# Altium schematic sheet Source Selection.SchDoc
size A3
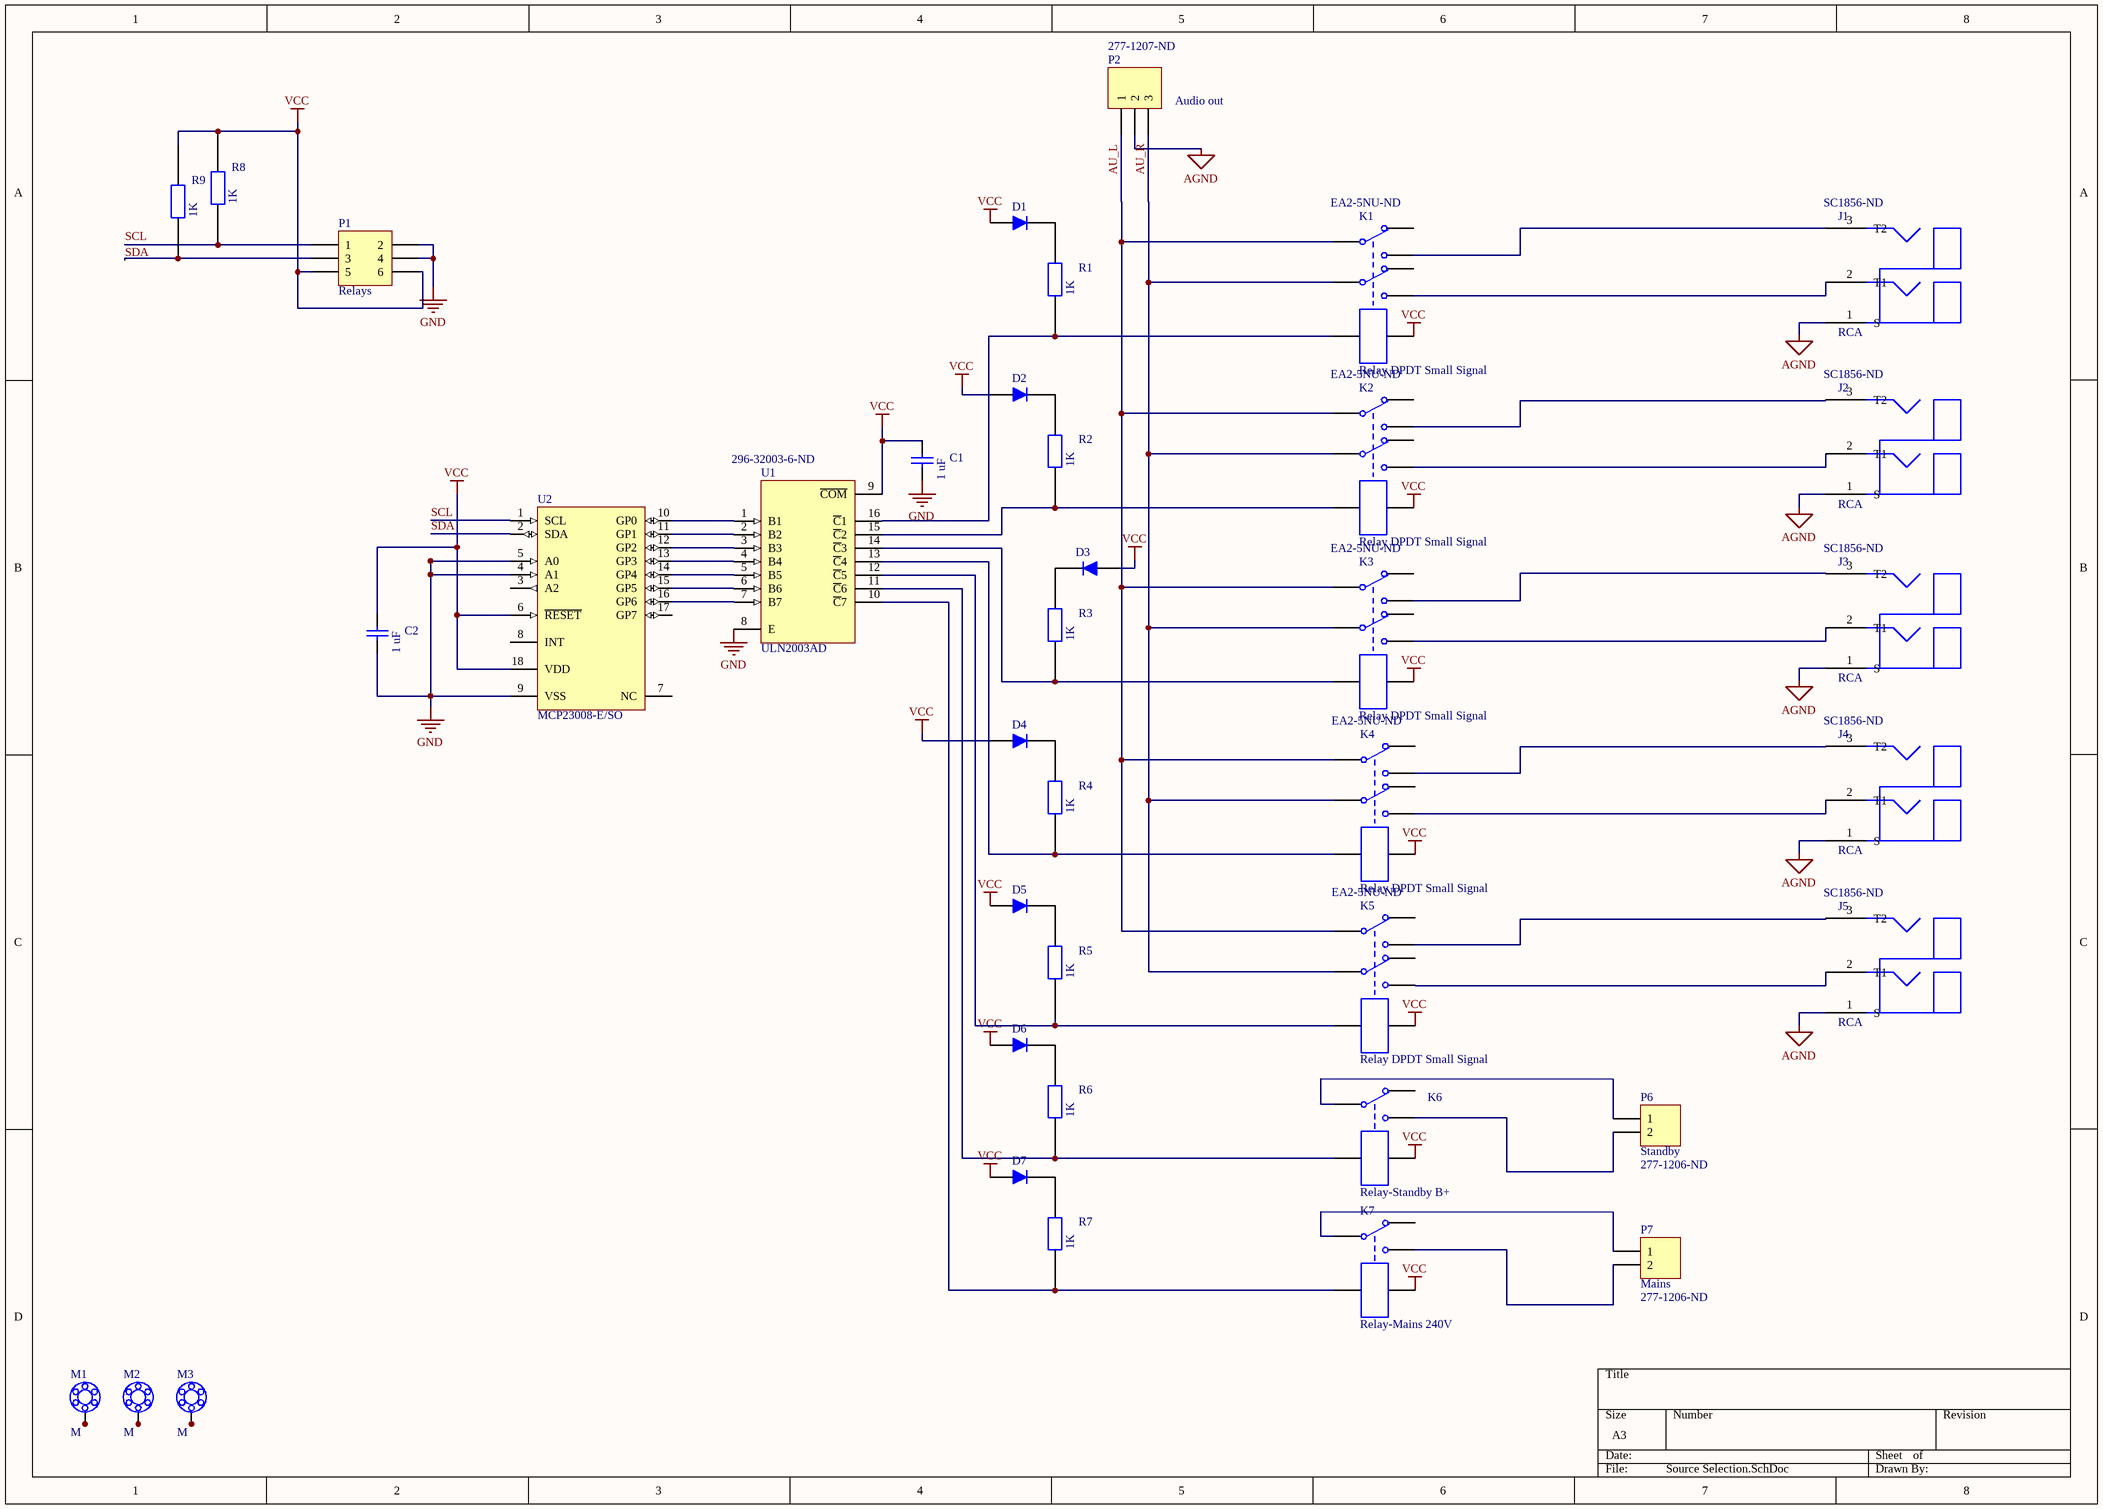
[diagram p0: Source Selection.SchDoc]

## Parts
C1  GCM188R71C105KA64D  [CAPC1608]  (value not drawn)
C2  GCM188R71C105KA64D  [CAPC1608]  (value not drawn)
D1  LTST-C191KGKT  [LEDC1608M_AK]  (value not drawn)
D2  LTST-C191KGKT  [LEDC1608M_AK]  (value not drawn)
D3  LTST-C191KGKT  [LEDC1608M_AK]  (value not drawn)
D4  LTST-C191KGKT  [LEDC1608M_AK]  (value not drawn)
D5  LTST-C191KGKT  [LEDC1608M_AK]  (value not drawn)
D6  LTST-C191KGKT  [LEDC1608M_AK]  (value not drawn)
D7  LTST-C191KGKT  [LEDC1608M_AK]  (value not drawn)
J1  RCA  Supplier Part Number 1: SC1856-ND  [PJRAS1X2S01AUX]
J2  RCA  Supplier Part Number 1: SC1856-ND  [PJRAS1X2S01AUX]
J3  RCA  Supplier Part Number 1: SC1856-ND  [PJRAS1X2S01AUX]
J4  RCA  Supplier Part Number 1: SC1856-ND  [PJRAS1X2S01AUX]
J5  RCA  Supplier Part Number 1: SC1856-ND  [PJRAS1X2S01AUX]
K1  Relay DPDT Small Signal  Supplier Part Number 1: EA2-5NU-ND  [DIP-P10]
K2  Relay DPDT Small Signal  Supplier Part Number 1: EA2-5NU-ND  [DIP-P10]
K3  Relay DPDT Small Signal  Supplier Part Number 1: EA2-5NU-ND  [DIP-P10]
K4  Relay DPDT Small Signal  Supplier Part Number 1: EA2-5NU-ND  [DIP-P10]
K5  Relay DPDT Small Signal  Supplier Part Number 1: EA2-5NU-ND  [DIP-P10]
K6  Relay-Standby B+  [RELAY_SPDT]
K7  Relay-Mains 240V  [RELAY_SPDT]
M1  M  [MOUNTING]  (no BOM)
M2  M  [MOUNTING]  (no BOM)
M3  M  [MOUNTING]  (no BOM)
P1  Relays  [IDC2.54-H6C]
P2  Audio out  Supplier Part Number 1: 277-1207-ND  [PH_TERM_3]
P6  Standby  Supplier Part Number 1: 277-1206-ND  [PH_TERM_2]
P7  Mains  Supplier Part Number 1: 277-1206-ND  [PH_TERM_2]
R1  CR0603-FX-1001ELF  [RESC1608]  (value not drawn)
R2  CR0603-FX-1001ELF  [RESC1608]  (value not drawn)
R3  CR0603-FX-1001ELF  [RESC1608]  (value not drawn)
R4  CR0603-FX-1001ELF  [RESC1608]  (value not drawn)
R5  CR0603-FX-1001ELF  [RESC1608]  (value not drawn)
R6  CR0603-FX-1001ELF  [RESC1608]  (value not drawn)
R7  CR0603-FX-1001ELF  [RESC1608]  (value not drawn)
R8  CR0603-FX-1001ELF  [RESC1608]  (value not drawn)
R9  CR0603-FX-1001ELF  [RESC1608]  (value not drawn)
U1  ULN2003AD  Supplier Part Number 1: 296-32003-6-ND  [D016_N]
U2  MCP23008-E/SO  [SOIC-SO18_N]

## Nets
AGND: J1.1(S) J2.1(S) J3.1(S) J4.1(S) J5.1(S) P2.2
GND: C1.1 C2.1 P1.2 P1.4 U1.8(E) U2.4(A1) U2.5(A0) U2.9(VSS)
VCC: C1.2 C2.2 D1.A D2.A D3.A D4.A D5.A D6.A D7.A K1.10 K2.10 K3.10 K4.10 K5.10 K6.3 K7.3 P1.5 P1.6 R8.2 R9.2 U1.9(~{COM}) U2.6(~{RESET}) U2.18(VDD)
AU_L: K1.3 K2.3 K3.3 K4.3 K5.3 P2.1
AU_R: K1.8 K2.8 K3.8 K4.8 K5.8 P2.3
SCL: P1.1 R8.1 U2.1(SCL)
SDA: P1.3 R9.1 U2.2(SDA)
NetD1_K: D1.K R1.2
NetD2_K: D2.K R2.2
NetD3_K: D3.K R3.2
NetD4_K: D4.K R4.2
NetD5_K: D5.K R5.2
NetD6_K: D6.K R6.2
NetD7_K: D7.K R7.2
NetJ1_2: J1.2(T1) K1.7
NetJ1_3: J1.3(T2) K1.4
NetJ2_2: J2.2(T1) K2.7
NetJ2_3: J2.3(T2) K2.4
NetJ3_2: J3.2(T1) K3.7
NetJ3_3: J3.3(T2) K3.4
NetJ4_2: J4.2(T1) K4.7
NetJ4_3: J4.3(T2) K4.4
NetJ5_2: J5.2(T1) K5.7
NetJ5_3: J5.3(T2) K5.4
NetK1_1: K1.1 R1.1 U1.16(~{C}1)
NetK2_1: K2.1 R2.1 U1.15(~{C}2)
NetK3_1: K3.1 R3.1 U1.14(~{C}3)
NetK4_1: K4.1 R4.1 U1.13(~{C}4)
NetK5_1: K5.1 R5.1 U1.12(~{C}5)
NetK6_1: K6.1 R6.1 U1.11(~{C}6)
NetK6_2: K6.2 P6.1
NetK6_5: K6.5 P6.2
NetK7_1: K7.1 R7.1 U1.10(~{C}7)
NetK7_2: K7.2 P7.1
NetK7_5: K7.5 P7.2
NetM1_1: M1.1 M1.2 M1.3 M1.4 M1.5 M1.6 M1.7
NetM2_1: M2.1 M2.2 M2.3 M2.4 M2.5 M2.6 M2.7
NetM3_1: M3.1 M3.2 M3.3 M3.4 M3.5 M3.6 M3.7
NetU1_1: U1.1(B1) U2.10(GP0)
NetU1_2: U1.2(B2) U2.11(GP1)
NetU1_3: U1.3(B3) U2.12(GP2)
NetU1_4: U1.4(B4) U2.13(GP3)
NetU1_5: U1.5(B5) U2.14(GP4)
NetU1_6: U1.6(B6) U2.15(GP5)
NetU1_7: U1.7(B7) U2.16(GP6)

Not connected (* = marked no-connect by the designer): K1 2 9; K2 2 9; K3 2 9; K4 2 9; K5 2 9; K6 4; K7 4; U2 3(A2) 7(NC) 8(INT) 17(GP7)

## Notes on the sheet
- (in symbol CR0603-FX-1001ELF) 1K

## Library data of the parts
C1 C2 = GCM188R71C105KA64D: Multilayer Ceramic Capacitors MLCC - SMD/SMT 0603 1.0uF 16volts X7R 10%; Manufacturer: Murata Electronics; Capacitance: 1 uF; Type: Automotive Ultra Small MLCC; Voltage Rating DC: 16 V; Supplier 1: Mouser; Manufacturer Part Number: GCM188R71C105KA64D; RoHS: RoHS Compliant; Category: Multilayer Ceramic Capacitors MLCC - SMD/SMT; Stock 1: 196143; Pricing 1: 1=0.432, 10=0.206, 100=0.122, 1000=0.114, 4000=0.080, 8000=0.077, 24000=0.074, 48000=0.069, 100000=0.061 (AUD); Height: 0.8 mm; Length: 1.6 mm; Package / Case: 0603 (1608 metric); Packaging: Reel; Product: Automotive MLCCs; Series: GCM; Termination Style: SMD/SMT; Tolerance: 10 %; Width: 0.8 mm; Brand: Murata Electronics; Case Code - in: 0603; Case Code - mm: 1608; Dielectric: X7R; Maximum Operating Temperature: + 125 C; Minimum Operating Temperature: - 55 C; Product Category: Automotive Ceramic Chip Capacitors; Standard Pack Qty: 4000; RoHS - Mouser: Y; Minimum Order Quantity: 1; Reeling: True; ComponentLink1URL: http://www.mouser.com/ds/2/281/c03e-516224.pdf; ComponentLink1Description: http://www.mouser.com/ds/2/281/c03e-516224.pdf; Supplier Part Number 1: 81-GCM188R71C105K64D
D1-D7 = LTST-C191KGKT: LED GREEN CLEAR 0603 SMD; Manufacturer: Lite-On Inc.; Wavelength - Dominant: 571nm; Wavelength - Peak: 574nm; Millicandela Rating: 35mcd; Voltage - Forward (Vf) (Typ): 2V; Current - Test: 20mA; Viewing Angle: 130°; Lens Color: Colorless; Lens Style/Size: Rectangle with Flat Top, 1.10mm x 0.80mm; Supplier 1: Digi-Key; Manufacturer Part Number: LTST-C191KGKT; RoHS: RoHS Compliant; Category: Optoelectronics; Stock 1: 654931; Pricing 1: 1=0.36, 10=0.284, 100=0.1549, 250=0.10328, 500=0.08778, 1000=0.06712, 2500=0.06067 (AUD); Packaging: Cut Tape (CT); Color: Green; Lens Transparency: Clear; Package / Case: 0603 (1608 Metric); Supplier Device Package: *; Size / Dimension: 1.60mm L x 0.80mm W; Height (Max): 0.55mm; Mounting Type: Surface Mount; ComponentLink1URL: http://optoelectronics.liteon.com/upload/download/DS22-2000-228/S_110_LTST-C191KGKT.pdf; ComponentLink1Description: http://optoelectronics.liteon.com/upload/download/DS22-2000-228/S_110_LTST-C191KGKT.pdf; Supplier Part Number 1: 160-1446-1-ND
J1-J5 = RCA Dual PCB: Manufacturer: Switchcraft Inc.; Connector Type: Phono (RCA) Jack; Gender: Female; Signal Lines: Mono; Plug/Mating Plug Diameter: 3.20mm ID, 9.00mm OD (RCA); Number of Positions/Contacts: 2 Sets of 2 Conductors, 3 Contacts; Internal Switch(s): Does Not Contain Switch; Shielding: Shielded; Color - Contact: Red, White; Voltage - Rated: 34VAC/DC; Current Rating: 2A; Supplier 1: Digi-Key; Manufacturer Part Number: PJRAS1X2S01AUX; RoHS: RoHS Compliant; Category: Connectors, Interconnects; Stock 1: 0; Pricing 1: 1000=1.66304 (AUD); Packaging: -; Mounting Type: Through Hole, Right Angle; Termination: Solder; Features: Grounding Tab; Contact Material: Copper Alloy; Contact Material - Plating: Gold; Housing Material: Thermoplastic; Housing Color: Black; Operating Temperature: -25°C ~ 85°C; ComponentLink1URL: http://www.switchcraft.com/Drawings/pjras1x2s__x_series_cd.pdf; ComponentLink1Description: http://www.switchcraft.com/Drawings/pjras1x2s__x_series_cd.pdf
K1-K5 = Relay DPDT Small Signal: Manufacturer: Kemet; Manufacturer Part Number: EA2-5NU; Supplier 1: Digi-Key; RoHS: RoHS Compliant; Category: Relays; Stock 1: 0; Pricing 1: 3600=1.65766 (AUD); ComponentLink1URL: http://www.kemet.com/docfinder?Partnumber=EA2-5NU; ComponentLink1Description: http://www.kemet.com/docfinder?Partnumber=EA2-5NU
K6 K7 = Relay SPDT
M1-M3 = MOUNTING: MOUNTING HOLE - NON INSTALLABLE
P1 = Header 3X2H: Header, 3-Pin, Dual row, Right Angle; Manufacturer: Wurth Electronics Inc; Manufacturer Part Number: 61200621721; Connector Type: Header, Shrouded; Number of Positions: 6; Number of Positions Loaded: All; Pitch: 0.100" (2.54mm); LatestRevisionDate: 17-Jul-2002; LatestRevisionNote: Re-released for DXP Platform.; Publisher: Altium Limited; Supplier 1: Digi-Key; Supplier Part Number 1: 732-5404-ND; RoHS: RoHS Compliant; Category: Connectors, Interconnects; Stock 1: 301; Pricing 1: 1=1.75, 100=1.5642, 500=1.32352 (AUD); Packaging: Tray; Contact Type: Male Pin; Number of Rows: 2; Row Spacing: 0.100" (2.54mm); Contact Mating Length: -; Mounting Type: Through Hole, Right Angle; Termination: Solder; Fastening Type: -; Features: -; Contact Finish: Gold; Contact Finish Thickness: -; Color: Black; ComponentLink1URL: http://katalog.we-online.de/em/datasheet/6120xx21721.pdf; ComponentLink1Description: http://katalog.we-online.de/em/datasheet/6120xx21721.pdf
P2 = Header 3: Header, 3-Pin; Manufacturer: Phoenix Contact; Manufacturer Part Number: 1803280; Number of Positions: 3; Number of Levels: 1; Pitch: 0.150" (3.81mm); Header Orientation: 90°, Right Angle; Current - IEC: 8A; Voltage - IEC: 250V; Voltage - UL: 300V; LatestRevisionDate: 17-Jul-2002; LatestRevisionNote: Re-released for DXP Platform.; Publisher: Altium Limited; Supplier 1: Digi-Key; RoHS: RoHS Compliant; Category: Connectors, Interconnects; Stock 1: 2295; Pricing 1: 1=1.59, 10=1.531, 50=1.4654, 100=1.4254, 250=1.33216, 500=1.22558, 1000=1.11013, 2500=1.05788, 5000=0.99258 (AUD); Packaging: Bulk; Type: Header, Male Pins, Shrouded (4 Side); Positions Per Level: 3; Plug Wire Entry: -; Termination Style: Solder; Mounting Type: Through Hole; Current - UL: 8A; Wire Gauge or Range - AWG: -; Wire Gauge or Range - mm²: -; Color: Green; Operating Temperature: -; Contact Mating Finish: Tin; Features: -; ComponentLink1URL: http://media.digikey.com/pdf/Data%20Sheets/Phoenix%20Contact%20PDFs/1803280.pdf; ComponentLink1Description: http://media.digikey.com/pdf/Data%20Sheets/Phoenix%20Contact%20PDFs/1803280.pdf
P6 P7 = Header 2: Header, 2-Pin; Manufacturer: Phoenix Contact; Manufacturer Part Number: 1803277; Number of Positions: 2; Number of Levels: 1; Pitch: 0.150" (3.81mm); Header Orientation: 90°, Right Angle; Current - IEC: 8A; Voltage - IEC: 250V; Voltage - UL: 300V; LatestRevisionDate: 17-Jul-2002; LatestRevisionNote: Re-released for DXP Platform.; Publisher: Altium Limited; Supplier 1: Digi-Key; RoHS: RoHS Compliant; Category: Connectors, Interconnects; Stock 1: 5115; Pricing 1: 1=1.05, 10=1.01, 50=0.9662, 100=0.9398, 250=0.87836, 500=0.80808, 1000=0.73195, 2500=0.69751, 5000=0.65445 (AUD); Packaging: Bulk; Type: Header, Male Pins, Shrouded (4 Side); Positions Per Level: 2; Plug Wire Entry: -; Termination Style: Solder; Mounting Type: Through Hole; Current - UL: 8A; Wire Gauge or Range - AWG: -; Wire Gauge or Range - mm²: -; Color: Green; Operating Temperature: -; Contact Mating Finish: Tin; Features: -; ComponentLink1URL: http://media.digikey.com/pdf/Data%20Sheets/Phoenix%20Contact%20PDFs/1803277.pdf; ComponentLink1Description: http://media.digikey.com/pdf/Data%20Sheets/Phoenix%20Contact%20PDFs/1803277.pdf
R1-R9 = CR0603-FX-1001ELF: RES SMD 1K OHM 1% 1/10W 0603; Manufacturer: Bourns Inc.; Power (Watts): 0.1W, 1/10W; Temperature Coefficient: ±100ppm/°C; Supplier 1: Digi-Key; Manufacturer Part Number: CR0603-FX-1001ELF; RoHS: RoHS Compliant; Category: Resistors; Stock 1: 28425; Pricing 1: 1=0.14, 10=0.065, 25=0.0472, 50=0.036, 100=0.0266, 250=0.02024, 500=0.01618, 1000=0.01193, 2500=0.01035 (AUD); Packaging: Digi-Reel®; Resistance (Ohms): 1k; Tolerance: ±1%; Composition: Thick Film; Features: Moisture Resistant; Operating Temperature: -55°C ~ 155°C; Package / Case: 0603 (1608 Metric); Supplier Device Package: 0603; Size / Dimension: 0.063" L x 0.031" W (1.60mm x 0.80mm); Height: 0.022" (0.55mm); Number of Terminations: 2; ComponentLink1URL: http://www.bourns.com/docs/Product-Datasheets/CHPREZTR.pdf; ComponentLink1Description: http://www.bourns.com/docs/Product-Datasheets/CHPREZTR.pdf; Supplier Part Number 1: CR0603-FX-1001ELFDKR-ND
U1 = ULN2003AD: Darlington Transistor Array; Manufacturer: Texas Instruments; Manufacturer Part Number: ULN2003ADRG4; Transistor Type: 7 NPN Darlington; Current - Collector (Ic) (Max): 500mA; Voltage - Collector Emitter Breakdown (Max): 50V; Vce Saturation (Max) @ Ib, Ic: 1.6V @ 500µA, 350mA; Published: 15-May-2002; LatestRevisionDate: 13-Apr-2006; LatestRevisionNote: IPC-7351 Footprint Added.; DatasheetVersion: Sep-1986; PackageVersion: Jan-1998; PackageReference: D016; Publisher: Altium Limited; PackageDescription: 16-Pin Small Outline Integrated Circuit 1.27 mm Pitch; Code_IPC: SOIC127P600-16; ComponentLink1Description: Manufacturer Link; ComponentLink1URL: http://www.ti.com/; ComponentLink2Description: Datasheet; ComponentLink2URL: http://www-s.ti.com/sc/ds/uln2002a.pdf; Supplier 1: Digi-Key; RoHS: RoHS Compliant; Category: Discrete Semiconductor Products; Stock 1: 3953; Pricing 1: 1=0.78, 10=0.666, 100=0.4977, 500=0.39094, 1000=0.30139 (AUD); Packaging: Digi-Reel®; Current - Collector Cutoff (Max): -; DC Current Gain (hFE) (Min) @ Ic, Vce: -; Power - Max: -; Frequency - Transition: -; Mounting Type: Surface Mount; Package / Case: 16-SOIC (0.154", 3.90mm Width); Supplier Device Package: 16-SOIC; ComponentLink3URL: http://www.ti.com/lit/ds/symlink/uln2003a.pdf; ComponentLink3Description: http://www.ti.com/lit/ds/symlink/uln2003a.pdf
U2 = MCP23008-E/SO: 8-Bit I/O Expander with Serial Interface, 18-Pin SOIC, Extended Temperature; Manufacturer: Microchip Technology; Number of I/O: 8; Interface: I²C; Interrupt Output: Yes; Output Type: Open Drain; Current - Output Source/Sink: 25mA; Frequency - Clock: 1.7MHz; Voltage - Supply: 1.8 V ~ 5.5 V; Published: 29-Jan-2009; DatasheetVersion: revE, Aug-2007; PackageVersion: revBB, Aug-2009; PackageReference: SOIC-SO18; Publisher: Altium Limited; PackageDescription: 18-Lead Plastic Small Outline (SO) - Wide 7.50mm Body [SOIC]; Supplier 1: Digi-Key; Supplier Part Number 1: MCP23008-E/SO-ND; Supplier 2: Farnell; Supplier Part Number 2: 1332086; Code_JEDEC: MS-013; ComponentLink1Description: Datasheet; ComponentLink1URL: http://ww1.microchip.com/downloads/en/DeviceDoc/21919e.pdf; ComponentLink2Description: Packaging Specification; ComponentLink2URL: http://www.microchip.com/stellent/groups/techpub_sg/documents/packagingspec/en012702.pdf; ComponentLink3Description: Microchip.com Home; ComponentLink3URL: http://www.microchip.com/; Manufacturer Part Number: MCP23008-E/SO; RoHS: RoHS Compliant; Category: Integrated Circuits (ICs); Stock 1: 4232; Pricing 1: 1=1.46, 25=1.22, 100=1.1195 (AUD); Packaging: Tube; Features: POR; Operating Temperature: -40°C ~ 125°C; Mounting Type: Surface Mount; Package / Case: 18-SOIC (0.295", 7.50mm Width); Supplier Device Package: 18-SOIC; ComponentLink4URL: http://www.microchip.com/mymicrochip/filehandler.aspx?ddocname=en021920; ComponentLink4Description: http://www.microchip.com/mymicrochip/filehandler.aspx?ddocname=en021920